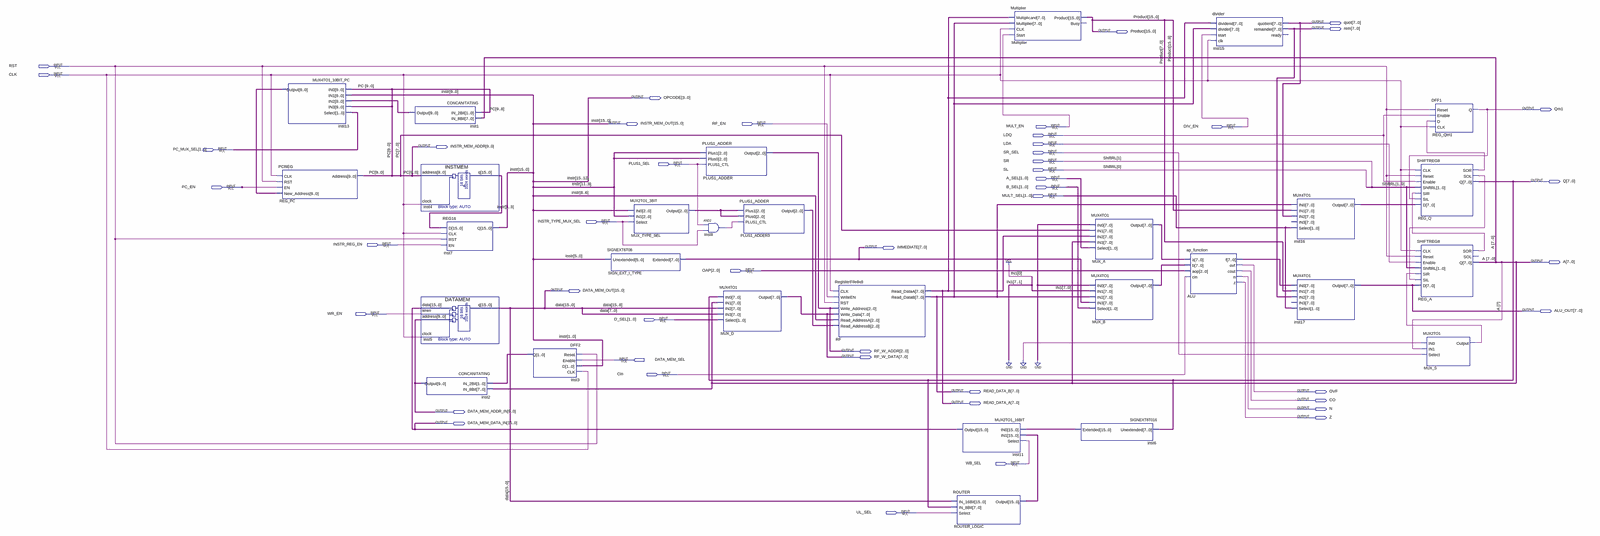
[diagram p0: schematic sheet, whole]
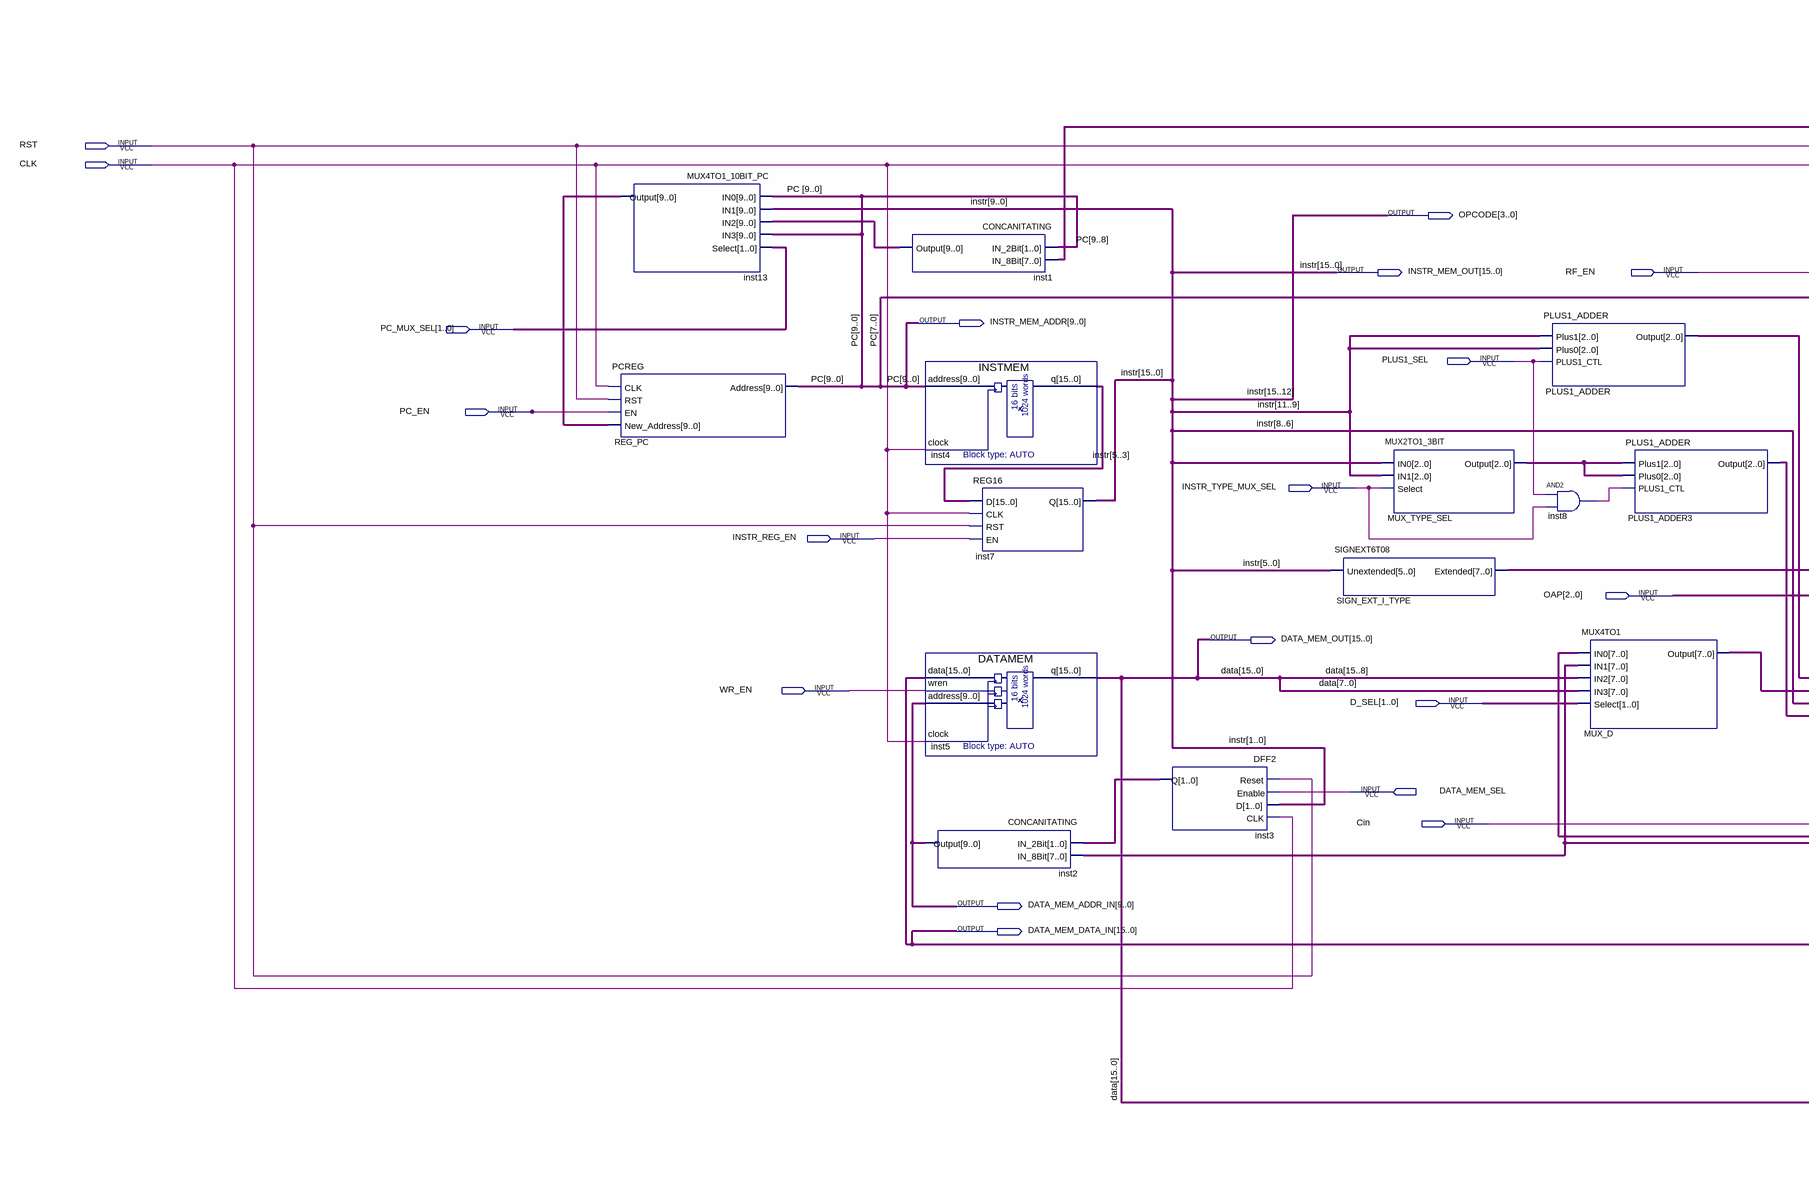
[diagram p1: schematic sheet, left part]
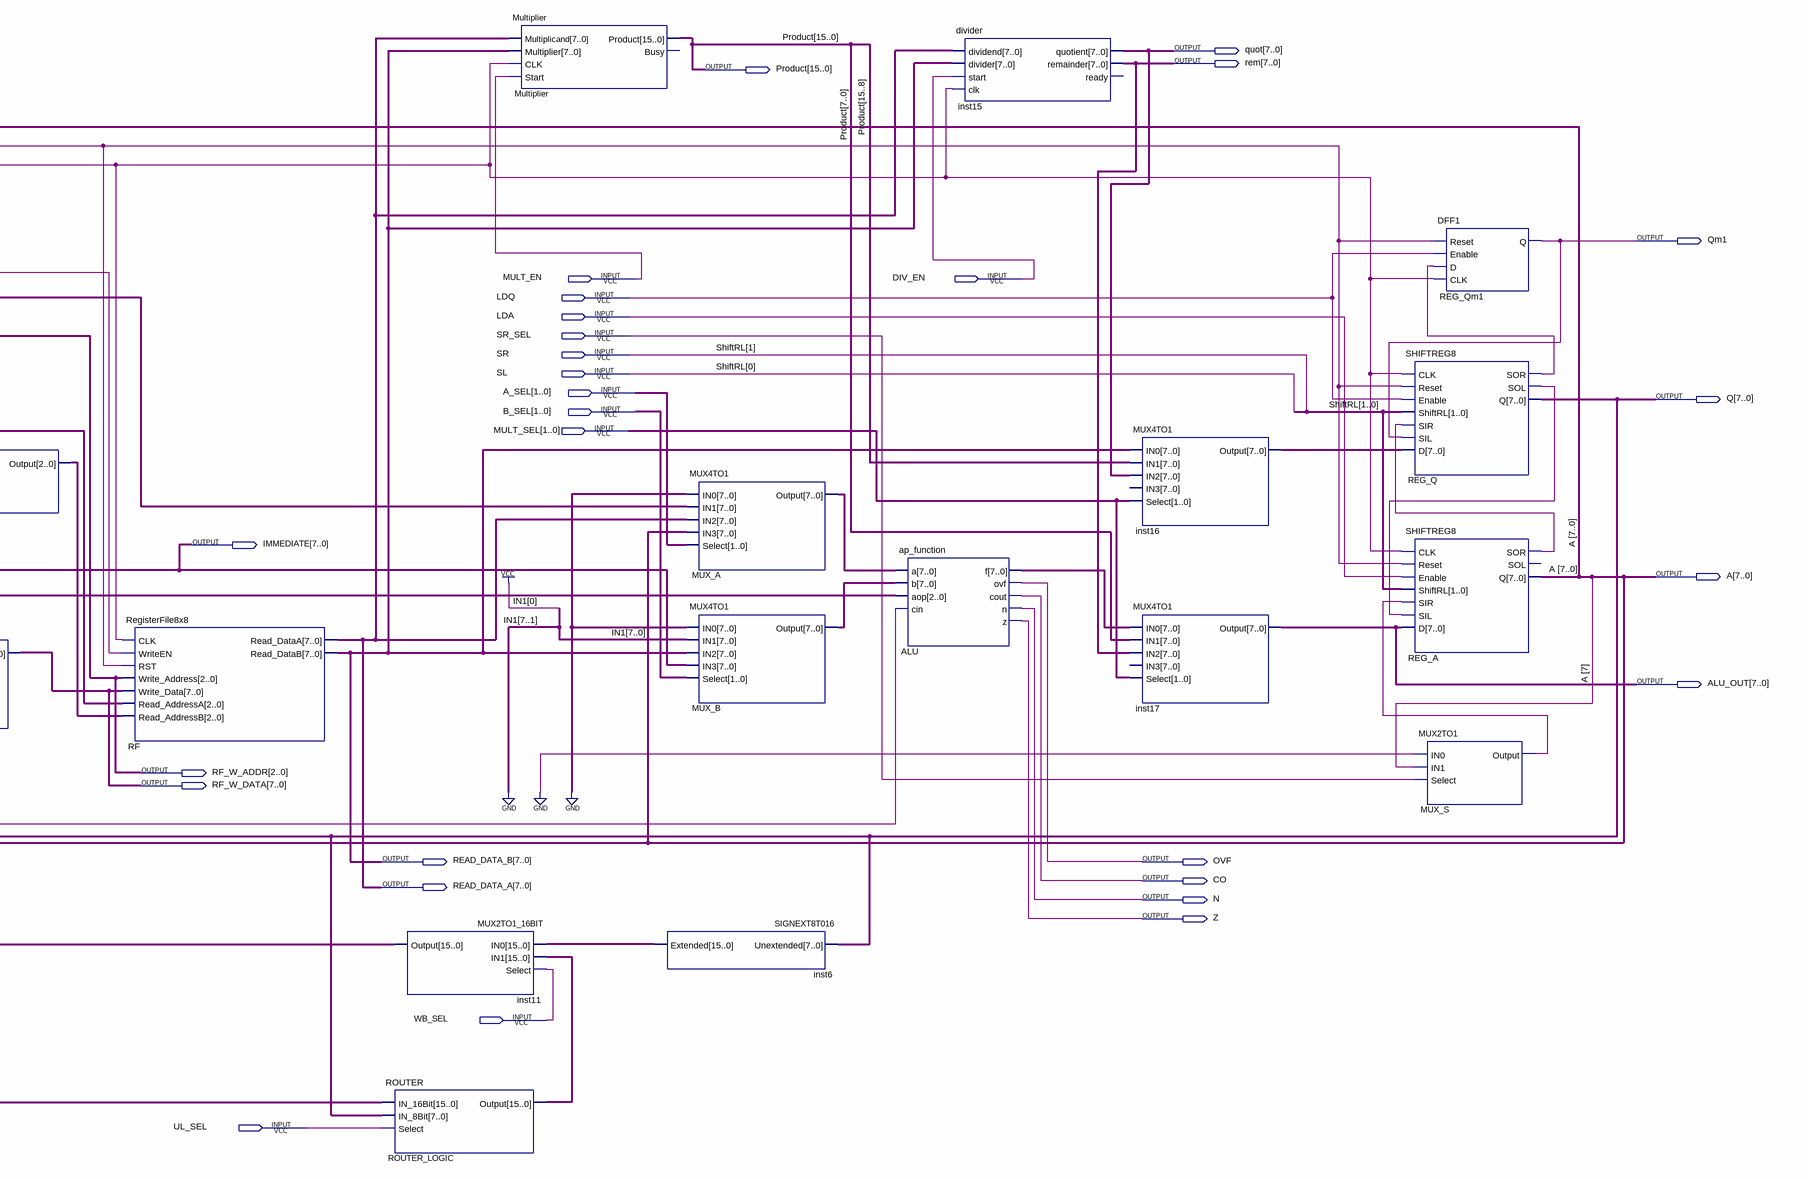
[diagram p2: schematic sheet, right part]
// Quartus schematic Datapath.bdf as structural Verilog: 29 symbols, 47 pins
module Datapath (
  input  RST,
  input  CLK,
  input  RF_EN,
  input  MULT_EN,
  input  DIV_EN,
  input  LDQ,
  input  LDA,
  input  [1:0] PC_MUX_SEL,
  input  SR_SEL,
  input  SR,
  input  PLUS1_SEL,
  input  SL,
  input  [1:0] A_SEL,
  input  PC_EN,
  input  [1:0] B_SEL,
  input  [1:0] MULT_SEL,
  input  INSTR_TYPE_MUX_SEL,
  input  INSTR_REG_EN,
  input  [2:0] OAP,
  input  WR_EN,
  input  [1:0] D_SEL,
  input  DATA_MEM_SEL,
  input  Cin,
  input  WB_SEL,
  input  UL_SEL,
  output [7:0] quot,
  output [7:0] rem,
  output [15:0] Product,
  output [3:0] OPCODE,
  output Qm1,
  output [15:0] INSTR_MEM_OUT,
  output [9:0] INSTR_MEM_ADDR,
  output [7:0] Q,
  output [7:0] IMMEDIATE,
  output [7:0] A,
  output [15:0] DATA_MEM_OUT,
  output [7:0] ALU_OUT,
  output [2:0] RF_W_ADDR,
  output [7:0] RF_W_DATA,
  output [7:0] READ_DATA_B,
  output OVF,
  output CO,
  output [7:0] READ_DATA_A,
  output N,
  output [9:0] DATA_MEM_ADDR_IN,
  output Z,
  output [15:0] DATA_MEM_DATA_IN
);

  wire inst8_out, MUX_S_output, REG_A_sor, REG_Q_sol, REG_Q_sor;
  wire [1:0] inst3_q;
  wire [2:0] MUX_TYPE_SEL_output, PLUS1_ADDER3_output;
  wire [7:0] ALU_f, inst16_output, MUX_A_output, MUX_B_output;
  wire [9:0] inst1_output, inst13_output;
  wire [15:0] inst4_q, inst6_extended, ROUTER_LOGIC_output;

  MUX4TO1_10BIT_PC inst13 (
    .IN0(INSTR_MEM_ADDR), .IN1(INSTR_MEM_OUT[9:0]), .IN2(inst1_output), .IN3(INSTR_MEM_ADDR),
    .Select(PC_MUX_SEL), .Output(inst13_output));
  PCREG REG_PC (.CLK(CLK), .RST(RST), .EN(PC_EN), .New_Address(inst13_output), .Address(INSTR_MEM_ADDR));
  CONCANITATING inst1 (.IN_2Bit(INSTR_MEM_ADDR[9:8]), .IN_8Bit(A), .Output(inst1_output));
  INSTMEM inst4 (.address(INSTR_MEM_ADDR), .clock(CLK), .q(inst4_q));
  DATAMEM inst5 (.data(DATA_MEM_DATA_IN), .wren(WR_EN), .address(DATA_MEM_ADDR_IN), .clock(CLK), .q(DATA_MEM_OUT));
  CONCANITATING inst2 (.IN_2Bit(inst3_q), .IN_8Bit(A), .Output(DATA_MEM_ADDR_IN));
  REG16 inst7 (.D(inst4_q), .CLK(CLK), .RST(RST), .EN(INSTR_REG_EN), .Q(INSTR_MEM_OUT));
  DFF2 inst3 (.Reset(RST), .Enable(DATA_MEM_SEL), .D(INSTR_MEM_OUT[1:0]), .CLK(CLK), .Q(inst3_q));
  SIGNEXT6T08 SIGN_EXT_I_TYPE (.Unextended(INSTR_MEM_OUT[5:0]), .Extended(IMMEDIATE));
  MUX2TO1_3BIT MUX_TYPE_SEL (
    .IN0(INSTR_MEM_OUT[5:3]), .IN1(INSTR_MEM_OUT[11:9]), .Select(INSTR_TYPE_MUX_SEL),
    .Output(MUX_TYPE_SEL_output));
  PLUS1_ADDER PLUS1_ADDER (
    .Plus1(INSTR_MEM_OUT[11:9]), .Plus0(INSTR_MEM_OUT[11:9]), .PLUS1_CTL(PLUS1_SEL), .Output(RF_W_ADDR));
  and inst8 (inst8_out, PLUS1_SEL, INSTR_TYPE_MUX_SEL);
  MUX4TO1 MUX_D (
    .IN0(Q), .IN1(A), .IN2(DATA_MEM_OUT[15:8]), .IN3(DATA_MEM_OUT[7:0]), .Select(D_SEL), .Output(RF_W_DATA));
  PLUS1_ADDER PLUS1_ADDER3 (
    .Plus1(MUX_TYPE_SEL_output), .Plus0(MUX_TYPE_SEL_output), .PLUS1_CTL(inst8_out),
    .Output(PLUS1_ADDER3_output));
  RegisterFile8x8 RF (
    .CLK(CLK), .WriteEN(RF_EN), .RST(RST), .Write_Address(RF_W_ADDR), .Write_Data(RF_W_DATA),
    .Read_AddressA(INSTR_MEM_OUT[8:6]), .Read_AddressB(PLUS1_ADDER3_output), .Read_DataA(READ_DATA_A),
    .Read_DataB(READ_DATA_B));
  MUX2TO1_16BIT inst11 (.IN0(inst6_extended), .IN1(ROUTER_LOGIC_output), .Select(WB_SEL), .Output(DATA_MEM_DATA_IN));
  ROUTER ROUTER_LOGIC (.IN_16Bit(DATA_MEM_OUT), .IN_8Bit(Q), .Select(UL_SEL), .Output(ROUTER_LOGIC_output));
  Multiplier Multiplier (
    .Multiplicand(READ_DATA_A), .Multiplier(READ_DATA_B), .CLK(CLK), .Start(MULT_EN), .Product(Product));  // open: Busy
  SIGNEXT8T016 inst6 (.Unextended(Q), .Extended(inst6_extended));
  MUX4TO1 MUX_A (
    .IN0({8{1'b0}}), .IN1(INSTR_MEM_ADDR[7:0]), .IN2(READ_DATA_A), .IN3(A), .Select(A_SEL),
    .Output(MUX_A_output));
  MUX4TO1 MUX_B (
    .IN0({8{1'b0}}), .IN1(8'b00000001), .IN2(READ_DATA_B), .IN3(IMMEDIATE), .Select(B_SEL),
    .Output(MUX_B_output));
  ap_function ALU (
    .a(MUX_A_output), .b(MUX_B_output), .aop(OAP), .cin(Cin), .f(ALU_f), .ovf(OVF), .cout(CO), .n(N), .z(Z));
  divider inst15 (
    .dividend(READ_DATA_A), .divider(READ_DATA_B), .start(DIV_EN), .clk(CLK), .quotient(quot), .remainder(rem));  // open: ready
  MUX4TO1 inst16 (
    .IN0(READ_DATA_B), .IN1(Product[15:8]), .IN2(quot), .Select(MULT_SEL), .Output(inst16_output));  // open: IN3
  MUX4TO1 inst17 (.IN0(ALU_f), .IN1(Product[7:0]), .IN2(rem), .Select(MULT_SEL), .Output(ALU_OUT));  // open: IN3
  SHIFTREG8 REG_Q (
    .CLK(CLK), .Reset(RST), .Enable(LDQ), .ShiftRL({SR, SL}), .SIR(REG_A_sor), .SIL(Qm1), .D(inst16_output),
    .SOR(REG_Q_sor), .SOL(REG_Q_sol), .Q(Q));
  SHIFTREG8 REG_A (
    .CLK(CLK), .Reset(RST), .Enable(LDA), .ShiftRL({SR, SL}), .SIR(MUX_S_output), .SIL(REG_Q_sol),
    .D(ALU_OUT), .SOR(REG_A_sor), .Q(A));  // open: SOL
  MUX2TO1 MUX_S (.IN0(1'b0), .IN1(A[7]), .Select(SR_SEL), .Output(MUX_S_output));
  DFF1 REG_Qm1 (.Reset(RST), .Enable(LDQ), .D(REG_Q_sor), .CLK(CLK), .Q(Qm1));

  assign OPCODE = INSTR_MEM_OUT[15:12];

  // Other names for the same wires on the sheet: data[15:0] = DATA_MEM_OUT; instr[15:0] = INSTR_MEM_OUT;
  //   PC[9:0] = INSTR_MEM_ADDR; ShiftRL[1:0] = {SR, SL}
endmodule
